# EAGLE design Komorebi_kit (EAGLE 9.2.0)
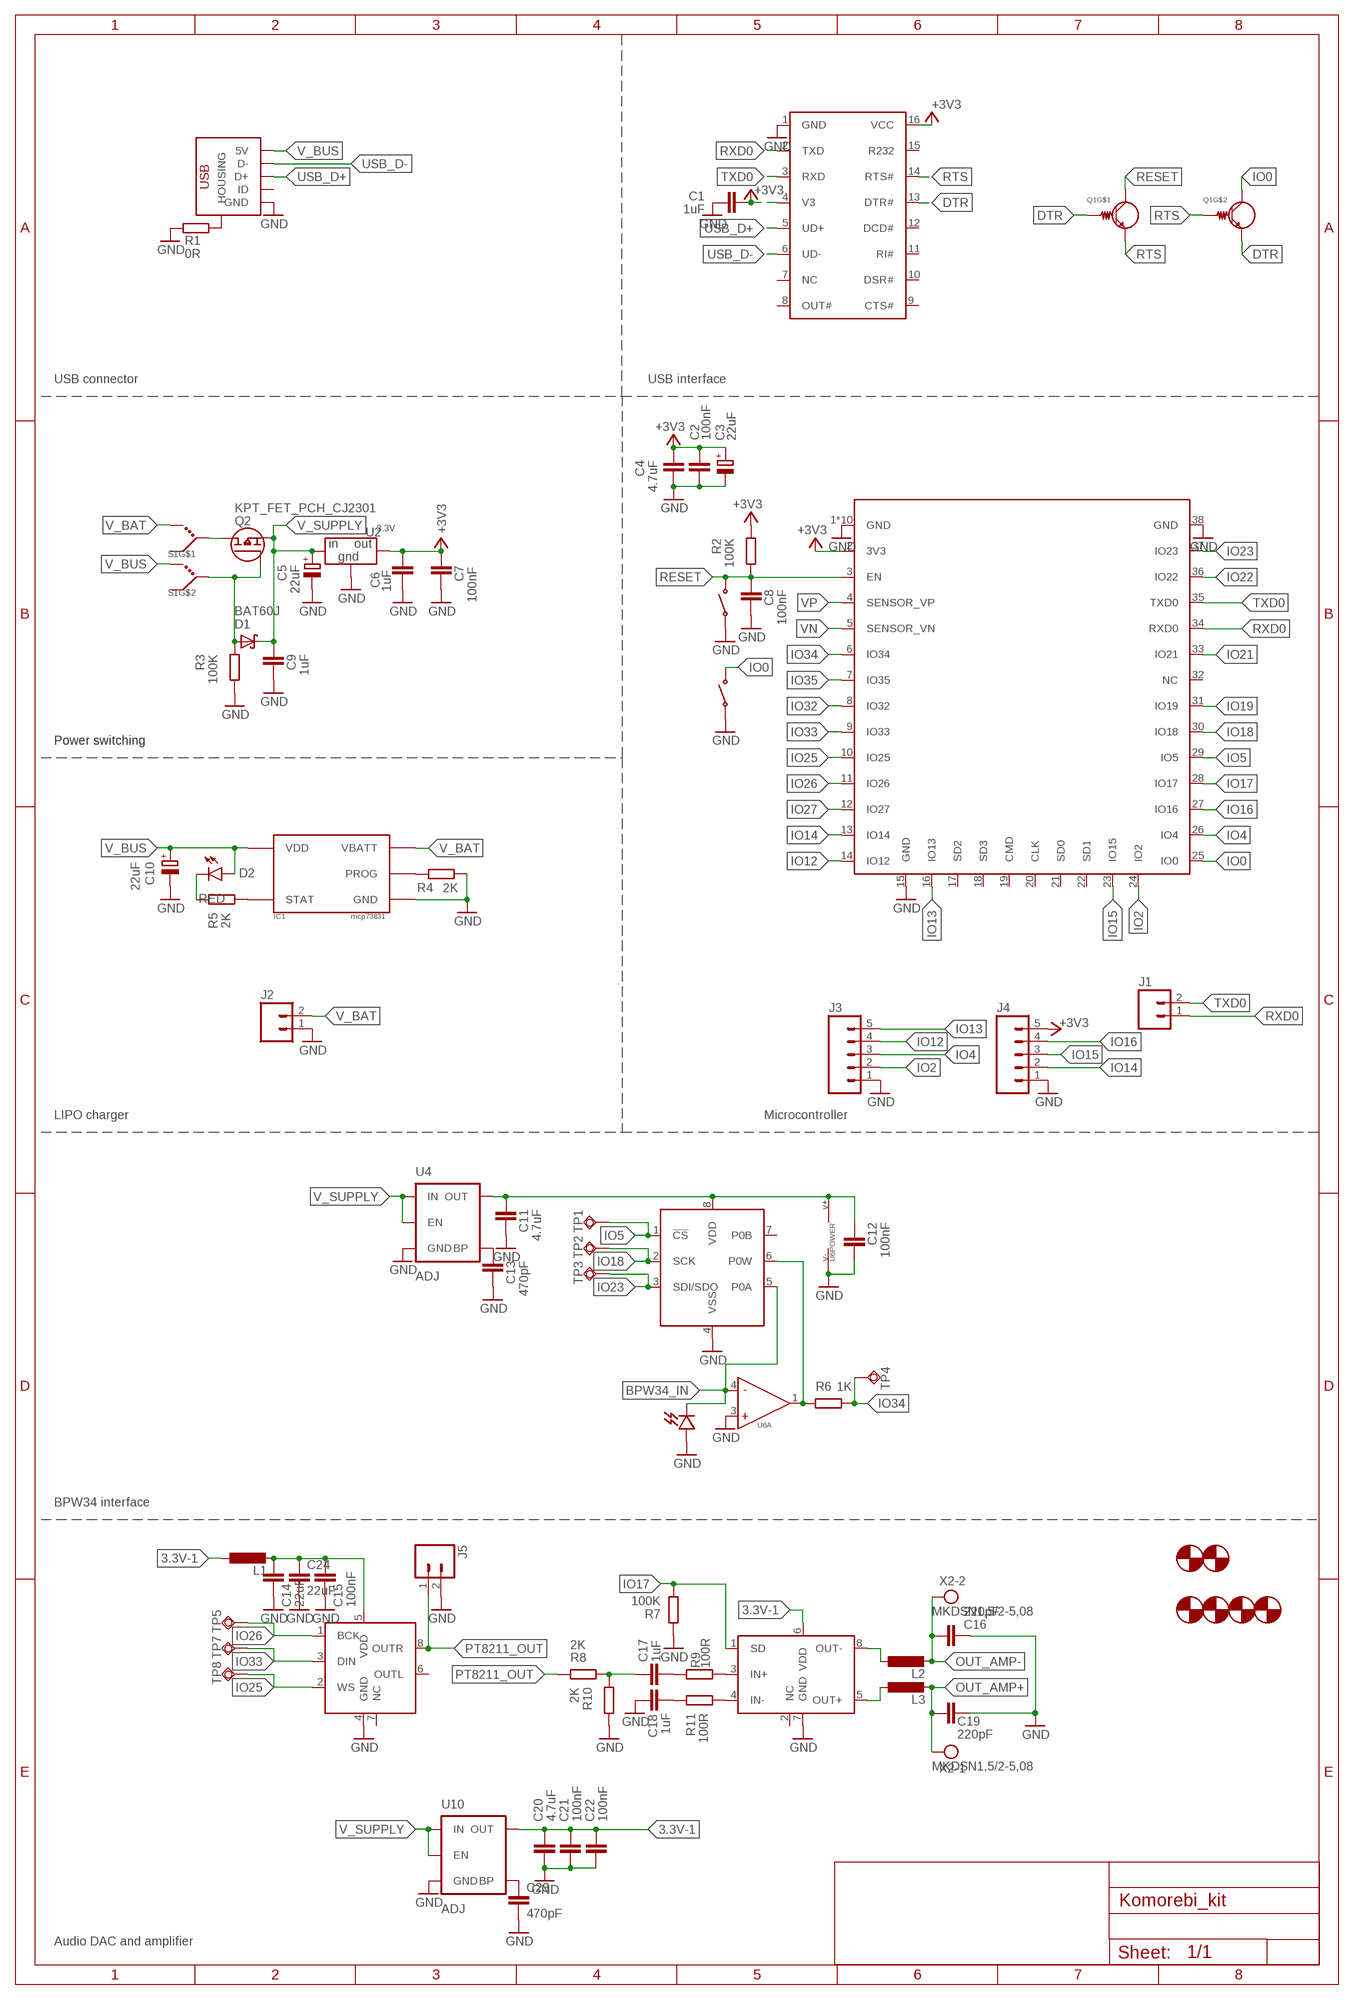
[diagram p0: schematic, sheet 1]

## Parts
C1  1uF  C-EUC0603  [C0603]
C2  100nF  C-EUC0603  [C0603]
C3  22uF  CPOL-EUB  [PANASONIC_B]
C4  4.7uF  C-EUC0603  [C0603]
C5  22uF  CPOL-EUB  [PANASONIC_B]
C6  1uF  C-EUC0603  [C0603]
C7  100nF  C-EUC0603  [C0603]
C8  100nF  C-EUC0603  [C0603]
C9  1uF  C-EUC0603  [C0603]
C10  22uF  CPOL-EUB  [PANASONIC_B]
C11  4.7uF  C-EUC0603  [C0603]
C12  100nF  C-EUC0603  [C0603]
C13  470pF  C-EUC0603  [C0603]
C14  22uF  C-EUC0805  [C0805]
C15  100nF  C-EUC0603  [C0603]
C16  220pF  C-EUC0603  [C0603]
C17  1uF  C-EUC0603  [C0603]
C18  1uF  C-EUC0603  [C0603]
C19  220pF  C-EUC0603  [C0603]
C20  4.7uF  C-EUC0603  [C0603]
C21  100nF  C-EUC0603  [C0603]
C22  100nF  C-EUC0603  [C0603]
C23  470pF  C-EUC0603  [C0603]
C24  22uF  C-EUC0805  [C0805]
D1  BAT60J  [SOD323_ST]
D2  RED  LED1206  [LED-1206]
D3  KPT_SENSORS_BPW34  [BPW34]
H1  KPT_HOLE3.0  [3.0MOUNTHOLE]
H2  KPT_HOLE3.0  [3.0MOUNTHOLE]
H3  KPT_HOLE4.1  [4.1MOUNTHOLE]
H4  KPT_HOLE4.1  [4.1MOUNTHOLE]
H5  KPT_HOLE4.1  [4.1MOUNTHOLE]
H6  KPT_HOLE4.1  [4.1MOUNTHOLE]
IC1  KPT_CHARGER_MCP73831  [SOT23-5]
J1  M02PTH  [1X02]
J2  M02PTH  [1X02]
J3  M05PTH  [1X05]
J4  M05PTH  [1X05]
J5  M02PTH  [1X02]
L1  L-EUL2012C  [L2012C]
L2  L-EUL2012C  [L2012C]
L3  L-EUL2012C  [L2012C]
Q1  KPT_UMH3N  [SOT363]
Q2  KPT_FET_PCH_CJ2301  [SOT23]
R1  0R  R-EU_R0603  [R0603]
R2  100K  R-EU_R0603  [R0603]
R3  100K  R-EU_R0603  [R0603]
R4  2K  R-EU_R0603  [R0603]
R5  2K  R-EU_R0603  [R0603]
R6  1K  R-EU_R0603  [R0603]
R7  100K  R-EU_R0603  [R0603]
R8  2K  R-EU_R0603  [R0603]
R9  100R  R-EU_R0603  [R0603]
R10  2K  R-EU_R0603  [R0603]
R11  100R  R-EU_R0603  [R0603]
S1  KPT_SWITCH_JS202011AQN  [C&K_JS202011AQN]
S2  TACT_SWITCH_C318884  [SWITCH_TACTILE_C318884]
S3  TACT_SWITCH_C318884  [SWITCH_TACTILE_C318884]
TP1  TPSQB1,27  [B1,27]
TP2  TPSQB1,27  [B1,27]
TP3  TPSQB1,27  [B1,27]
TP4  TPSQB1,27  [B1,27]
TP5  TPSQB1,27  [B1,27]
TP7  TPSQB1,27  [B1,27]
TP8  TPSQB1,27  [B1,27]
U1  KPT_CH340C  [SOIC16]
U2  3.3V  KPT_VREG_APT7215  [SOT-89-3L]
U3  KPT_ESP32  [WROOM_ESP32]
U4  ADJ  V_REG_MIC5205ADJ  [SOT23-5]
U5  KPT_DIGIPOT_MCP41X1SOIC8  [SOIC-8]
U6  KPT_OPAMP_MCP6001  [SOT23-5]
U7  KPT_DAC_PT8211  [SOIC-8]
U8  KPT_AMP-D_PAM8302SOIC8  [SOIC-8]
U10  ADJ  V_REG_MIC5205ADJ  [SOT23-5]
X1  USB_MICROB_C10418  [USB_MICROB_C10418]
X2  MKDSN1,5/2-5,08  [MKDSN1,5/2-5,08]

## Nets
3.3V-1: C20.1 C21.1 C22.1 L1.1 U8.6(VDD) U10.5(OUT)
+3V3: C1.2 C2.1 C3.+ C4.2 C6.1 C7.1 J4.5 R2.2 U1.4(V3) U1.16(VCC) U2.P$3(OUT) U3.2(3V3)
BPW34_IN: D3.CATHODE U5.5(P0A) U6.4(A:-)
DTR: Q1.2(BASE) Q1.4(EMITTER) U1.13(DTR#)
GND: C1.1 C2.2 C3.- C4.1 C5.- C6.2 C7.2 C8.2 C9.2 C10.- C11.2 C12.2 C13.2 C14.2 C15.2 C16.1 C18.1 C19.1 C20.2 C21.2 C22.2 C23.2 C24.2 D3.ANODE IC1.2(GND) J2.1 J3.1 J4.1 J5.2 R1.1 R3.1 R4.2 R7.1 R10.1 S2.A S2.B S3.A S3.B U1.1(GND) U2.P$1(GND) U3.1(GND) U3.15(GND) U3.38(GND) U3.BP1(GND) U3.BP2(GND) U3.BP3(GND) U3.BP4(GND) U3.BP5(GND) U3.BP6(GND) U3.BP7(GND) U3.BP8(GND) U3.BP9(GND) U4.2(GND) U5.4(VSS) U6.2(POWER:V-) U6.3(A:+) U7.4(GND) U8.7(GND) U10.2(GND) X1.P$1(GND)
IN_AMP1: C17.1 R8.2 R10.2
IO0: Q1.3(COLLECTOR) S3.C S3.D U3.25(IO0)
IO2: J3.2 U3.24(IO2)
IO4: J3.3 U3.26(IO4)
IO5: TP1.TP U3.29(IO5) U5.1(!CS!)
IO12: J3.4 U3.14(IO12)
IO13: J3.5 U3.16(IO13)
IO14: J4.2 U3.13(IO14)
IO15: J4.3 U3.23(IO15)
IO16: J4.4 U3.27(IO16)
IO17: R7.2 U3.28(IO17) U8.1(SD)
IO18: TP2.TP U3.30(IO18) U5.2(SCK)
IO19: U3.31(IO19)
IO21: U3.33(IO21)
IO22: U3.36(IO22)
IO23: TP3.TP U3.37(IO23) U5.3(SDI/SDO)
IO25: TP8.TP U3.10(IO25) U7.2(WS)
IO26: TP5.TP U3.11(IO26) U7.1(BCK)
IO27: U3.12(IO27)
IO32: U3.8(IO32)
IO33: TP7.TP U3.9(IO33) U7.3(DIN)
IO34: R6.1 TP4.TP U3.6(IO34)
IO35: U3.7(IO35)
N$1: C14.1 C15.1 C24.1 L1.2 U7.5(VDD)
N$2: C11.1 C12.1 U4.5(OUT) U5.8(VDD) U6.5(POWER:V+)
N$3: R1.2 X1.P$6(HOUSING) X1.P$7(HOUSING) X1.P$8(HOUSING) X1.P$9(HOUSING)
N$4: C17.2 R9.1
N$5: C18.2 R11.1
N$6: R9.2 U8.3(IN+)
N$7: IC1.5(PROG) R4.1
N$8: R11.2 U8.4(IN-)
N$9: C23.1 U10.4(BP)
N$11: L2.1 U8.8(OUT-)
N$12: L3.1 U8.5(OUT+)
N$18: D1.A Q2.1(G) R3.2 S1.P$5(COM)
N$19: Q2.3(D) S1.P$2(COM)
N$25: D2.C R5.1
N$39: C13.1 U4.4(BP)
N$40: IC1.1(STAT) R5.2
N$41: R6.2 U5.6(P0W) U6.1(A:OUT)
OUT_AMP+: C19.2 L3.2 X2.1
OUT_AMP-: C16.2 L2.2 X2.2
PT8211_OUT: J5.1 R8.1 U7.8(OUTR)
RESET: C8.1 Q1.6(COLLECTOR) R2.1 S2.C S2.D U3.3(EN)
RTS: Q1.1(EMITTER) Q1.5(BASE) U1.14(RTS#)
RXD0: J1.1 U1.2(TXD) U3.34(RXD0)
TXD0: J1.2 U1.3(RXD) U3.35(TXD0)
USB_D+: U1.5(UD+) X1.P$3(D+)
USB_D-: U1.6(UD-) X1.P$4(D-)
V_BAT: IC1.3(VBATT) J2.2 S1.P$3(SW_ACTION)
V_BUS: C10.+ D2.A IC1.4(VDD) S1.P$6(SW_ACTION) X1.P$5(5V)
V_SUPPLY: C5.+ C9.1 D1.C Q2.2(S) U2.P$2(IN) U2.P$4(IN) U4.1(IN) U4.3(EN) U10.1(IN) U10.3(EN)
VN: U3.5(SENSOR_VN)
VP: U3.4(SENSOR_VP)
Unconnected: S1.P$1(SW_REST) S1.P$4(SW_REST) U1.7(NC) U1.8(OUT#) U1.9(CTS#) U1.10(DSR#) U1.11(RI#) U1.12(DCD#) U1.15(R232) U3.17(SD2) U3.18(SD3) U3.19(CMD) U3.20(CLK) U3.21(SD0) U3.22(SD1) U3.32(NC) U5.7(P0B) U7.6(OUTL) U7.7(NC) U8.2(NC) X1.P$2(ID)

## Notes on the sheet
- USB connector | USB interface
- Power switching | Power switching
- LIPO charger | Microcontroller
- BPW34 interface
- Audio DAC and amplifier

## Library data of the parts
C1 C2 C4 C6-C9 C11-C24 = rcl:C-EU: CAPACITOR, European symbol; SPICEPREFIX: C
C3 C5 C10 = rcl:CPOL-EU: POLARIZED CAPACITOR, European symbol; SPICEPREFIX: C
D1 = diode:BAT60J: Schottky barrier diode Source: www.st.com, BAT60J.pdf
D2 = SparkFun-LED:LED: LEDs Standard schematic elements and footprints for 5mm, 3mm, 1206, and 0603 sized LEDs. 5mm - Spark Fun Electronics SKU : COM-00529 (and others)
D3 = KPT_own:KPT_SENSORS_BPW34
H1-H6 = KPT_own:KPT_HOLE
IC1 = KPT_own:KPT_CHARGER_MCP73831: single cell LiPo charger, 15 to 500 mA, 4,2 Volt. Input range 3.75 to 6 Volt
J1 J2 J5 = SparkFun-Connectors:M02: Standard 2-pin 0.1" header. Use with - straight break away headers ( PRT-00116) - right angle break away headers (PRT-00553) - swiss pins (PRT-00743) - machine pins (PRT-00117) - female headers (PRT-00115) Molex polarized connector foot print use with: PRT-08233 with associated crimp pins and housings. 2.54_SCREWTERM for use with PRT-10571. 3.5mm Screw Terminal footprints for PRT-08084 5mm Screw Terminal footprints for use with PRT-08432
J3 J4 = SparkFun-Connectors:M05: Header 5 Standard 5-pin 0.1" header. Use with straight break away headers (SKU : PRT-00116), right angle break away headers (PRT-00553), swiss pins (PRT-00743), machine pins (PRT-00117), and female headers (PRT-00115). Molex polarized connector foot print use with SKU : PRT-08230 with associated crimp pins and housings.
L1-L3 = rcl:L-EU: INDUCTOR, European symbol; SPICEPREFIX: L
Q1 = KPT_own:KPT_UMH3N
Q2 = KPT_own:KPT_FET_PCH_CJ2301
R1-R11 = rcl:R-EU_: RESISTOR, European symbol; SPICEPREFIX: R
S1 = KPT_own:KPT_SWITCH_JS202011AQN
S2 S3 = KPT_LCSC_Parts:TACT_SWITCH_C318884
TP1-TP5 TP7 TP8 = testpad:TPSQ: Test pad
U1 = KPT_own:KPT_CH340C
U2 = KPT_own:KPT_VREG_APT7215
U3 = KPT_own:KPT_ESP32
U4 U10 = SparkFun-PowerIC:V_REG_MIC5205: V_REG MIC5205 Standard 3.3V, 5V, and Adjustable 150mA LDO voltage regulator in SOT-23 layout. Micrel part MIC5205. BP (by-pass) pin is used to lower output noise with 470pF cap, may be left open. On the adjustable version BP is used to set output.; PROD_ID: VREG-12594
U5 = KPT_own:KPT_DIGIPOT_MCP41X1
U6 = KPT_own:KPT_OPAMP_MCP6001: General purpose, rail to rail, low power opamp. 1.6 to 6.0 V supply
U7 = KPT_own:KPT_DAC_PT8211
U8 = KPT_own:KPT_AMP-D_PAM8302
X1 = KPT_LCSC_Parts:USB_MICROB_C10418
X2 = con-phoenix-508:MKDSN1,5/2-5,08: MKDSN 1,5/ 2-5,08 Printklemme Nennstrom: 13,5 A Nennspannung: 250 V Rastermaß: 5,08 mm Polzahl: 2 Anschlussart: Schraubanschluss Montage: Löten Anschlussrichtung Leiter/Platine: 0 ° Artikelnummer: 1729128 Source: http://eshop.phoenixcontact.com .. 1729128.pdf

## Board
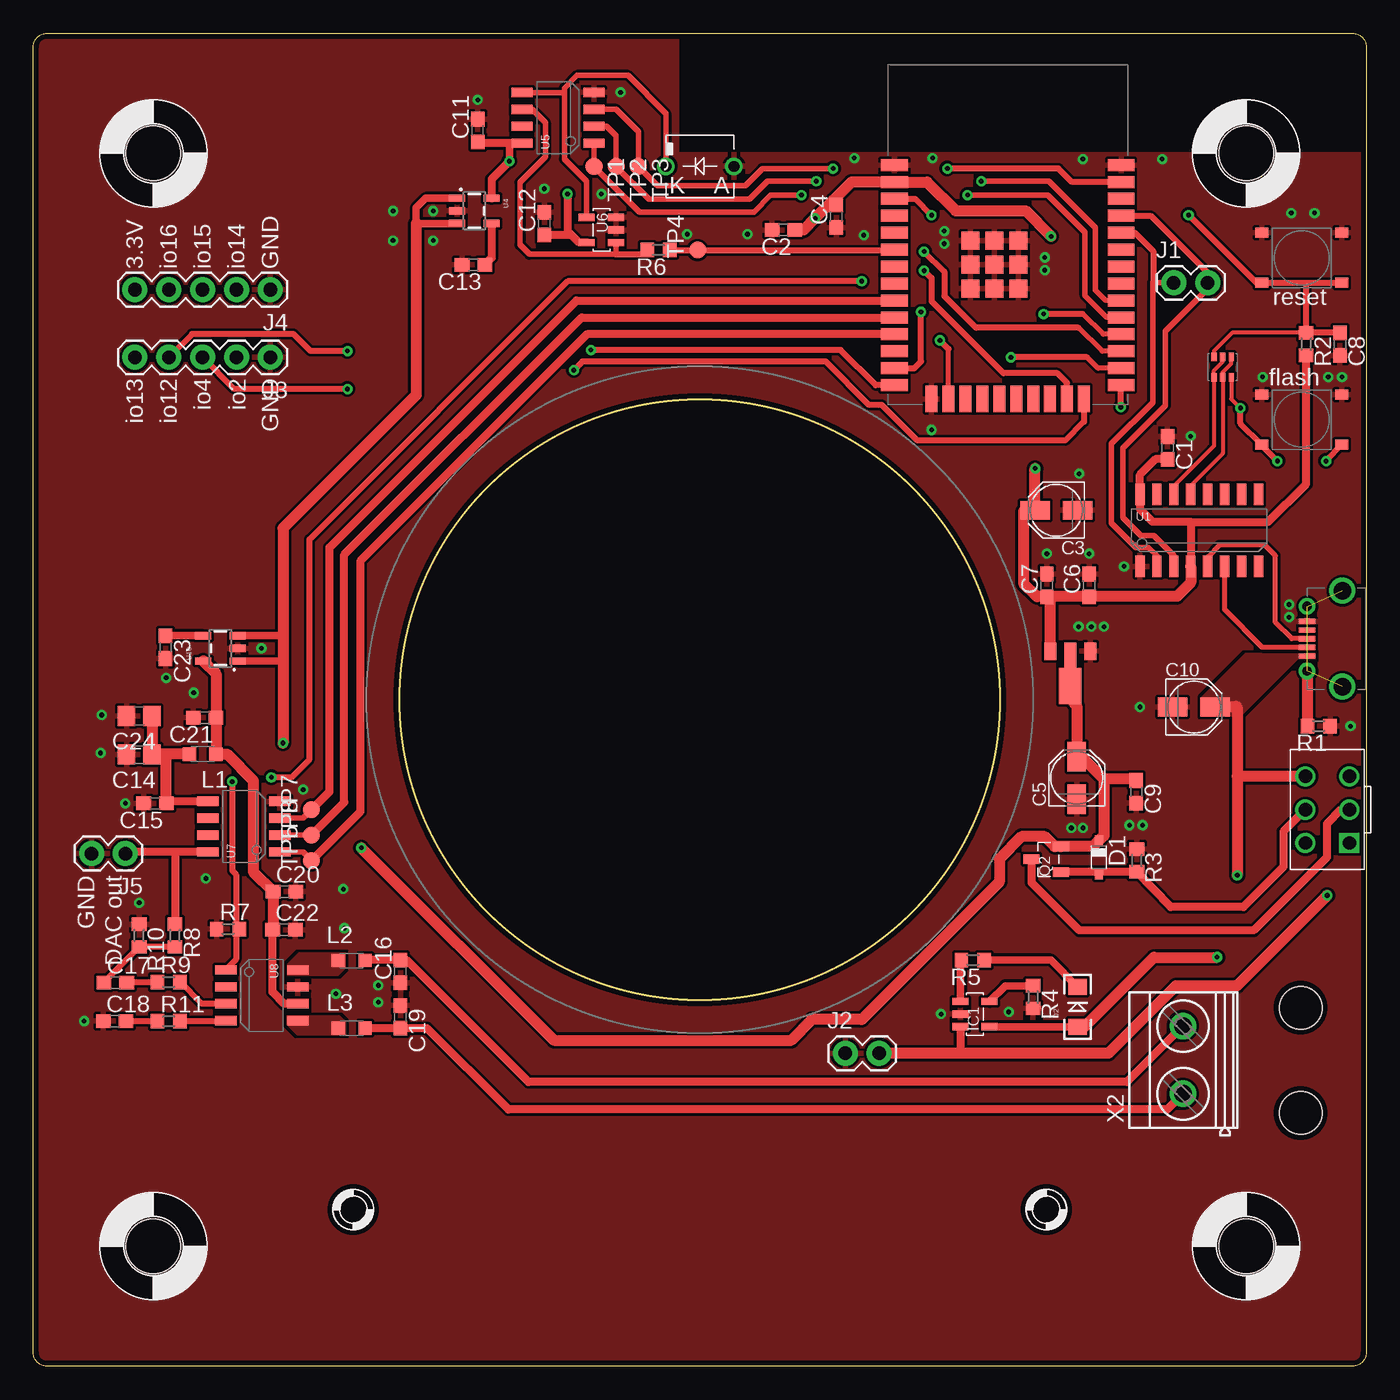
[diagram p1: board, top side]
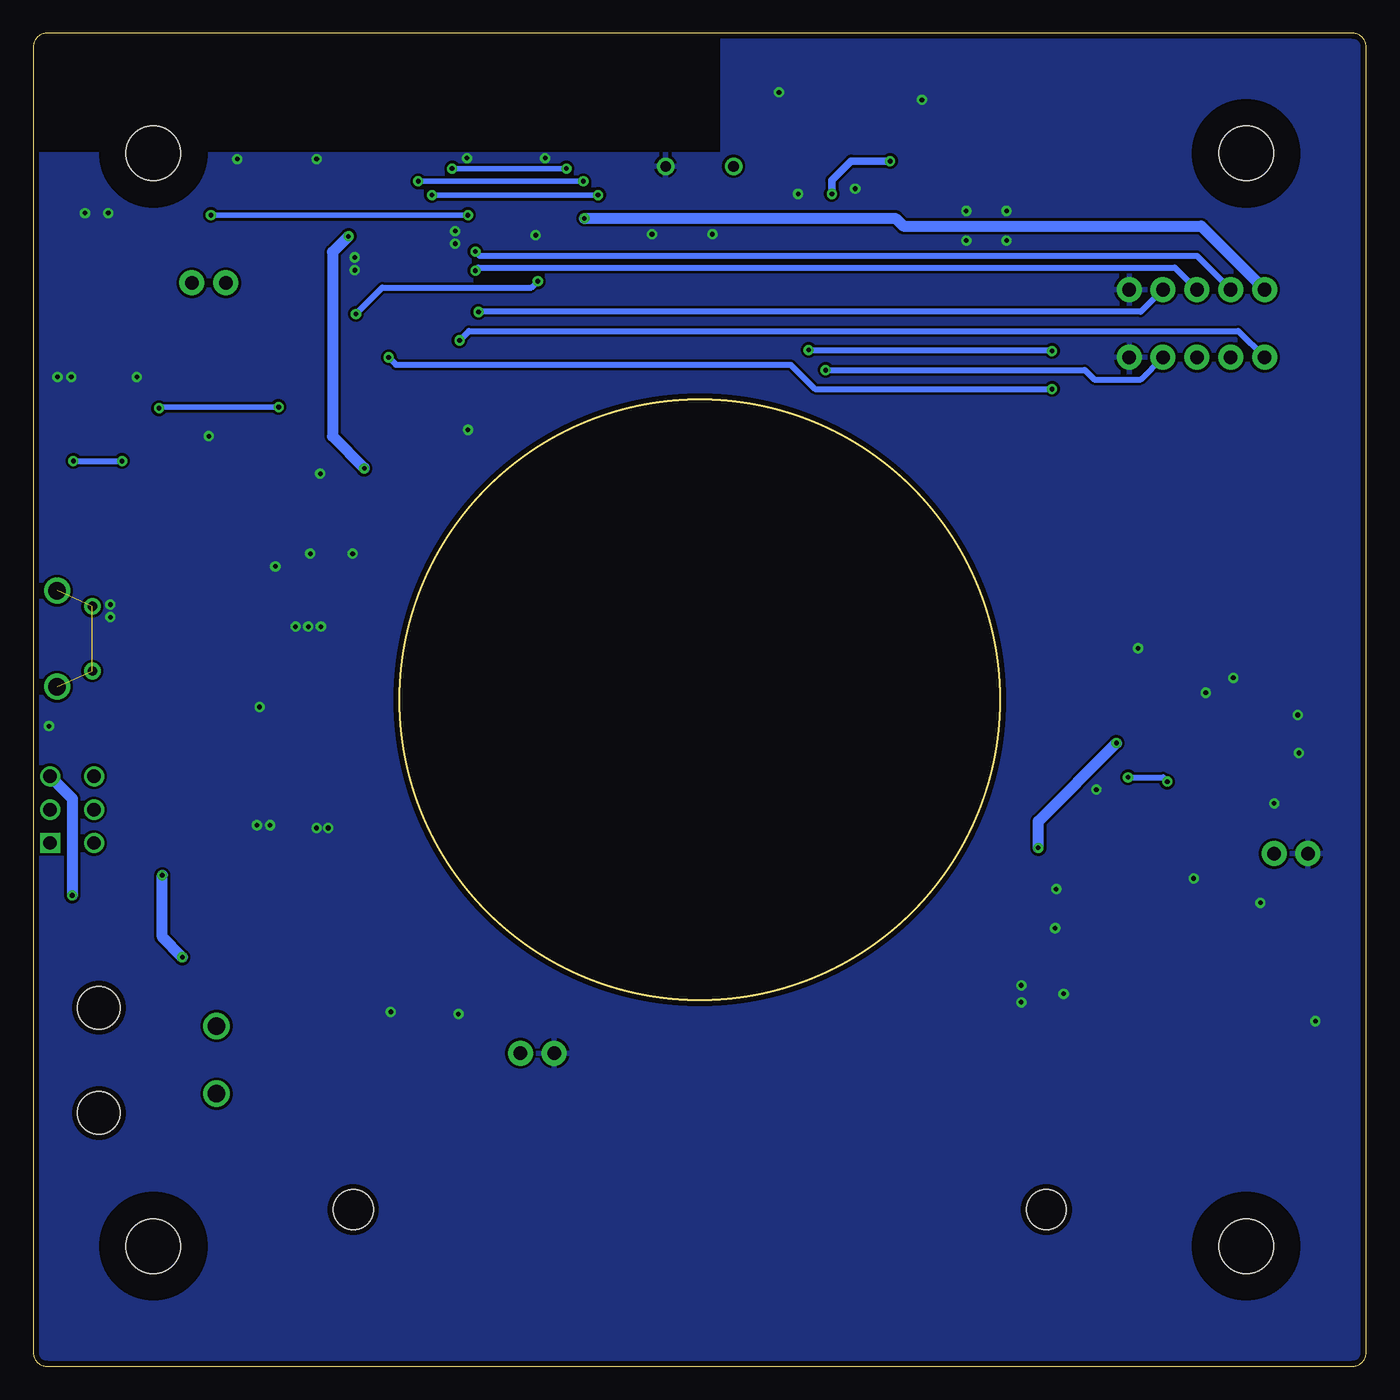
[diagram p2: board, bottom side, seen from below]

Size 100 x 100 mm. Coordinates in mm from the lower left corner, seen from the top.
Outline: 1,0 arc-90 0,1 0,99 arc-90 1,100 99,100 arc-90 100,99 100,1 arc-90 99,0 1,0
Outline: circle at 50,50 radius 22.5
Copper layers (1*16): Top 0.035mm / dielectric 1.5mm / Bottom 0.035mm
Design rules "KPT_standard": minimum track width 8mil, minimum drill 0.35mm, track to track 8mil, track to pad 8mil, pad to pad 8mil, via to via 8mil, smd to smd 8mil, copper to edge 16mil, drill to drill 8mil, minimum pad ring 10mil, minimum via ring 8mil, stop-mask expansion 4mil, vias tented up to drill 0mil, thermal gap 8mil
Holes 3.2 mm at 95.09,26.9 95.09,19

### Footprints (pad centres in the part's own frame; a part is rotated, then mirrored left to right if it is on the bottom)
C0603 = smd 1.1 x 1: 1 -0.85,0; 2 0.85,0
PANASONIC_B = smd 2.2 x 1.4: + 1.6,0; - -1.6,0
C0805 = smd 1.3 x 1.5: 1 -0.95,0; 2 0.95,0
SOD323_ST = smd 0.8 x 0.6: A 1.25,0; C -1.25,0
LED-1206 = smd 1.2 x 1.4: A -1.5,0; C 1.5,0
BPW34 = drill 0.8: ANODE -2.55,0; CATHODE 2.55,0
3.0MOUNTHOLE = hole 3: 0,0
4.1MOUNTHOLE = hole 4.1: 0,0
SOT23-5 = smd 0.55 x 1.2: 1 0.95,1.1; 2 0,1.1; 3 -0.95,1.1; 4 -0.95,-1.1; 5 0.95,-1.1
1X02 = drill 1.016 pad 1.88: 1 0,0; 2 2.54,0
1X05 = drill 1.016 pad 1.88: 1 0,0; 2 2.54,0; 3 5.08,0; 4 7.62,0; 5 10.16,0
L2012C = smd 1 x 1: 1 -1,0; 2 1,0
SOT363 = smd 0.65 x 0.4: 1 -0.775,0.65; 2 -0.775,0; 3 -0.775,-0.65; 4 0.775,-0.65; 5 0.775,0; 6 0.775,0.65
SOT23 = smd 0.711 x 1.2: 1 -0.95,-1.1; 2 0.95,-1.1; 3 0,1.1
R0603 = smd 1 x 1.1: 1 -0.85,0; 2 0.85,0
C&K_JS202011AQN = drill 1 square: P$1 -2.5,0 | drill 1: P$2 0,0; P$3 2.5,0; P$4 -2.5,3.3; P$5 0,3.3; P$6 2.5,3.3
SWITCH_TACTILE_C318884 = smd 1 x 0.75: A -3,1.875; B 3,1.875; C -3,-1.875; D 3,-1.875
B1,27 = smd 1.27 x 1.27: TP 0,0
SOIC16 = smd 1.6 x 0.7: 1 -2.7,4.445; 2 -2.7,3.175; 3 -2.7,1.905; 4 -2.7,0.635; 5 -2.7,-0.635; 6 -2.7,-1.905; 7 -2.7,-3.175; 8 -2.7,-4.445; 9 2.7,-4.445; 10 2.7,-3.175; 11 2.7,-1.905; 12 2.7,-0.635; 13 2.7,0.635; 14 2.7,1.905; 15 2.7,3.175; 16 2.7,4.445
SOT-89-3L = smd 0.9 x 1.3: P$1 -1.5,-1.5; P$3 1.5,-1.5 | smd 0.9 x 1.9: P$2 0,-1.2 | smd 1.7 x 2.7: P$4 0,1.1
WROOM_ESP32 = smd 2 x 0.9: 1 -8.5,3.2; 2 -8.5,1.93; 3 -8.5,0.66; 4 -8.5,-0.61; 5 -8.5,-1.88; 6 -8.5,-3.15; 7 -8.5,-4.42; 8 -8.5,-5.69; 9 -8.5,-6.96; 10 -8.5,-8.23; 11 -8.5,-9.5; 12 -8.5,-10.77; 13 -8.5,-12.04; 14 -8.5,-13.31; 25 8.51,-13.31; 26 8.51,-12.04; 27 8.51,-10.77; 28 8.51,-9.5; 29 8.51,-8.23; 30 8.51,-6.96; 31 8.51,-5.69; 32 8.51,-4.42; 33 8.51,-3.15; 34 8.51,-1.88; 35 8.51,-0.61; 36 8.51,0.66; 37 8.51,1.93; 38 8.51,3.2 | smd 0.9 x 2: 15 -5.71,-14.35; 16 -4.44,-14.35; 17 -3.17,-14.35; 18 -1.9,-14.35; 19 -0.63,-14.35; 20 0.64,-14.35; 21 1.91,-14.35; 22 3.18,-14.35; 23 4.45,-14.35; 24 5.72,-14.35 | smd 1.33 x 1.33: BP1 -2.8,-2.48; BP2 -1,-2.48; BP3 0.8,-2.48; BP4 -2.8,-4.28; BP5 -1,-4.28; BP6 0.8,-4.28; BP7 -2.8,-6.08; BP8 -1,-6.08; BP9 0.8,-6.08
SOT23-5' = smd 0.55 x 1.2: 1 -0.95,-1.3; 2 0,-1.3; 3 0.95,-1.3; 4 0.95,1.3; 5 -0.95,1.3
SOIC-8 = smd 1.6 x 0.7: 1 -2.7,1.905; 2 -2.7,0.635; 3 -2.7,-0.635; 4 -2.7,-1.905; 5 2.7,-1.905; 6 2.7,-0.635; 7 2.7,0.635; 8 2.7,1.905
USB_MICROB_C10418 = smd 0.4 x 1.25: P$1 -1.3,-2.54; P$2 -0.65,-2.54; P$3 0,-2.54; P$4 0.65,-2.54; P$5 1.3,-2.54 | drill 0.7 pad 1.25: P$6 -2.425,-2.54; P$7 2.425,-2.54 | drill 1.3: P$8 3.6,0.11; P$9 -3.6,0.11
MKDSN1,5/2-5,08 = drill 1.3 pad 2: 1 -2.561,0.025; 2 2.519,0.025

### Placement (x,y rotation side)
C1  85.09,68.9 270 top
C2  56.28,85.25 180 top
C3  76.76,64.21 180 top
C4  60.25,86.28 90 top
C5  78.28,44.14 90 top
C6  79.22,58.58 90 top
C7  76.04,58.58 90 top
C8  98.03,76.68 270 top
C9  82.75,43.09 270 top
C10  87.07,49.45 0 top
C11  33.34,92.71 90 top
C12  38.34,85.72 90 top
C13  33.02,82.63 180 top
C14  7.94,45.88 180 top
C15  9.13,42.23 180 top
C16  27.54,29.62 90 top
C17  6.16,28.78 0 top
C18  6.11,25.89 0 top
C19  27.54,26.21 270 top
C20  18.85,35.61 0 top
C21  12.86,48.66 180 top
C22  18.81,32.75 0 top
C23  9.92,53.94 270 top
C24  7.94,48.78 180 top
D1  79.94,38.18 270 top
D2  78.34,26.97 90 top
D3  50.01,90.02 180 top
H1  24,11.75 0 top
H2  76,11.75 0 top
H3  9,9 0 top
H4  9,91 0 top
H5  91,9 0 top
H6  91,91 0 top
IC1  70.65,26.42 90 top
J1  85.57,81.28 0 top
J2  60.92,23.48 0 top
J3  17.78,75.69 180 top
J4  17.78,80.77 180 top
J5  6.91,38.46 180 top
L1  12.7,45.92 180 top
L2  23.89,30.45 0 top
L3  23.89,25.37 0 top
Q1  89.23,74.96 90 top
Q2  75.99,38.03 90 top
R1  96.44,48.02 180 top
R2  95.49,76.68 270 top
R3  82.79,37.94 270 top
R4  75.01,27.69 270 top
R5  70.49,30.47 180 top
R6  46.91,83.74 180 top
R7  14.61,32.79 0 top
R8  10.64,32.31 270 top
R9  10.16,28.81 0 top
R10  7.94,32.31 270 top
R11  10.16,25.88 0 top
S1  98.74,41.75 90 top
S2  95.17,83.15 0 top
S3  95.17,71.01 0 top
TP1  42.07,90.01 270 top
TP2  43.74,90.01 270 top
TP3  45.4,90.01 270 top
TP4  49.85,83.74 90 top
TP5  20.88,37.94 90 top
TP7  20.88,41.75 90 top
TP8  20.88,39.85 90 top
U1  87.47,62.71 90 top
U2  77.79,52.15 180 top
U3  73.1,86.92 0 top
U4  ADJ  [SOT23-5']  33.1,86.68 270 top
U5  39.37,93.66 180 top
U6  42.62,85.25 270 top
U7  15.8,40.48 180 top
U8  17.14,27.83 0 top
U10  ADJ  [SOT23-5']  14.05,53.86 90 top
X1  98.11,54.58 270 top
X2  86.28,23 90 top

### Tracks (layer width: path | path; a pad name or v marks a point on that pad's centre or on a via)
3.3V-1
  Top 0.61: U8.6 18.81,27.19 17.94,28.06 17.94,32.73 18,32.78
  Top 0.813: C22.1 18,32.78 C20.1 16.51,37.09 16.51,43.94 14.53,45.92 L1.1 13.71,45.93 C21.1 13.71,51.95 U10.5
+3V3  (via drill 0.35)
  Top 0.61: 86.84,63.34 83.98,63.34 83.03,64.29 U1.16 83.03,66.88 84.19,68.05 C1.2 | 86.84,63.34 92.63,63.34 95.49,66.2 R2.2 | 86.84,63.34 U1.4
  Top 0.635: 79.24,57.75 C6.1
  Top 0.813: v76.36,84.77 74.45,86.68 69.22,86.68 67.05,88.85 U3.2 61.38,88.85 60.03,87.49 | 60.03,87.49 v58.66,86.12 57.78,85.25 C2.1 | C4.2 60.03,87.35 60.03,87.49 | U1.4 86.84,58.78 85.8,57.75 79.24,57.75 | C6.1 C7.1 | C7.1 75.3,57.73 74.3,58.74 74.3,64.13 74.37,64.21 C3.+ 75.16,67.34 v75.17,67.36 | U2.P$3 76.29,57.48 C7.1
  Bottom 0.813: v76.36,84.77 77.55,83.58 77.55,69.77 75.17,67.39 v75.17,67.36 | v58.66,86.12 35.32,86.12 34.73,85.53 12.38,85.53 J4.5
BPW34_IN
  Top 0.406: U6.4 41.52,88.89 39.85,90.57 39.85,95.53 | 39.85,95.53 39.85,95.89 40.8,96.84 44.61,96.84 47.47,93.98 D3.CATHODE | U5.5 36.7,95.53 39.85,95.53
DTR
  Top 0.305: Q1.4 89.88,75.21 89.23,74.56 Q1.2 89.23,68.48 86.84,66.09 U1.13
GND  (via drill 0.35)
  other vias: 30,86.68 38.34,88.34 44.05,95.57 49.05,84.93 42.62,87.95 30,84.45 33.34,95.01 53.58,84.93 61.59,90.65 62.31,84.85 84.69,90.57 67.39,70.25 94.38,86.52 96.12,86.52 86.84,69.77 98.19,74.22 81.84,60.01 79.22,60.96 76.04,60.96 94.22,57.15 94.22,56.2 83.03,49.45 79.38,55.48 78.75,40.38 83.22,40.59 82.24,40.59 73.19,26.58 68.11,26.42 25.88,27.3 25.88,28.57 22.7,27.94 3.81,25.89 12.94,36.59 23.26,35.8 7.94,34.77 6.91,42.23 20.24,43.26 5.05,46 78.47,66.96 5.13,48.86 77.88,40.38 98.82,48.02 26.99,86.68 67.47,90.65 26.99,84.45 78.74,90.57 23.34,32.86 92.23,74.22 97.16,74.22 68.34,85.17 68.34,84.22 75.88,83.19 75.88,82.23 78.42,55.48 80.33,55.48 9.97,51.64 17.11,53.86 12.03,50.53
  pour Bottom: -0.11,-0.02 100.01,-0.02 100.01,90.88 48.26,90.88 48.26,100.01 -0.11,100.01
  pour Top (rank 2): -0.11,-0.02 100.01,-0.02 100.01,90.88 48.26,90.88 48.26,100.01 -0.11,100.01
IN_AMP1
  Top 0.432: C17.1 5.31,28.83 R10.2 R8.2
IO0  (via drill 0.35)
  Top 0.305: Q1.3 89.88,72.57 v90.57,71.88
  Top 0.432: v93.34,67.91 92.17,69.09 S3.C 90.57,70.74 v90.57,71.88 | S3.D 97,67.96 v97,67.91 | v81.6,71.96 81.6,73.59 U3.25
  Bottom 0.406: v90.57,71.88 90.49,71.96 v81.6,71.96
  Bottom 0.432: v97,67.91 v93.34,67.91
IO2  (via drill 0.35)
  Top 0.432: v40.56,74.74 41.2,75.37 41.73,75.37 41.74,75.37 42.4,75.37 59.45,75.37 62.71,72.12 63.66,72.12 66.33,69.45 77.42,69.45 78.82,70.85 U3.24
  Bottom 0.432: v40.56,74.74 21.11,74.74 20.4,74.02 16.91,74.02 J3.2
IO4  (via drill 0.35)
  Top 0.381: U3.26 79.87,74.88 79.06,75.69
  Top 0.432: 79.06,75.69 v73.34,75.69 | v23.57,73.31 15.08,73.31 J3.3
  Bottom 0.432: v73.34,75.69 72.79,75.13 43.18,75.13 41.35,73.31 v23.57,73.31
IO5  (via drill 0.35)
  Top 0.381: U3.29 80.54,78.69 78.9,80.33
  Top 0.406: 78.9,80.33 78.9,85.09 76.12,87.87 v70.09,87.87 | U5.1 TP1.TP 45.48,86.6 54.05,86.6 55.32,87.87 v57.63,87.87
  Bottom 0.406: v70.09,87.87 v57.63,87.87
IO12  (via drill 0.35)
  Top 0.432: v41.83,76.25 60.56,76.25 63.2,73.61 U3.14 | v23.57,76.17 20.8,76.17 19.53,77.44 11.91,77.44 J3.4
  Bottom 0.432: v41.83,76.25 23.65,76.25 v23.57,76.17
IO13  (via drill 0.35)
  Top 0.381: U3.16 68.66,76.32
  Top 0.432: 68.66,76.32 v68.02,76.96
  Bottom 0.432: J3.5 9.6,77.67 67.31,77.67 v68.02,76.96
IO14  (via drill 0.35)
  Top 0.432: v66.6,79.1 66.6,75.37 66.1,74.88 U3.13
  Bottom 0.432: J4.2 16.91,79.1 v66.6,79.1
IO15  (via drill 0.35)
  Top 0.432: v66.83,82.2 67.39,81.64 67.39,79.9 72.79,74.5 76.83,74.5 77.55,73.78 U3.23
  Bottom 0.432: v66.83,82.2 66.6,82.44 14.37,82.44 J4.3
IO16  (via drill 0.35)
  Top 0.381: U3.27 80.19,76.15 78.42,77.91
  Top 0.432: 78.42,77.91 70.72,77.91 68.34,80.29 68.34,82.12 v66.83,83.63
  Bottom 0.432: v66.83,83.63 66.52,83.31 12.7,83.31 J4.4
IO17  (via drill 0.35)
  Top 0.381: U3.28 80.27,77.42 78.74,78.94
  Top 0.432: v14.92,43.86 14.92,37.19 15.22,36.9 15.22,33.03 R7.2 15.22,32.56 15.22,30.5 U8.1 | 78.74,78.94 v75.8,78.94 | v62.15,81.41 40.08,81.41 20.72,62.04 20.72,45.53 19.37,44.18 v17.86,44.18
  Bottom 0.432: v14.92,43.86 15.24,44.18 v17.86,44.18 | v62.15,81.41 62.63,80.93 73.82,80.93 v75.8,78.94
IO18  (via drill 0.35)
  Top 0.381: U3.30 80.46,79.96 79.69,80.72
  Top 0.406: 79.69,80.72 79.69,85.41 76.2,88.9 v71.12,88.9 | U5.2 43.02,93.03 43.74,92.31 TP2.TP 46.2,87.55 53.74,87.55 55.09,88.9 v58.74,88.9
  Bottom 0.406: v71.12,88.9 v58.74,88.9
IO23  (via drill 0.35)
  Top 0.406: U5.3 43.74,94.3 45.4,92.63 TP3.TP 46.83,88.58 53.42,88.58 54.69,89.85 v60.01,89.85
  Top 0.432: v68.58,89.85 76.91,89.85 77.92,88.85 U3.37
  Bottom 0.406: v68.58,89.85 v60.01,89.85
IO25
  Top 0.406: TP8.TP U7.2
  Top 0.61: TP8.TP 23.34,42.31 23.34,60.88 41.14,78.69 U3.10
IO26
  Top 0.406: U7.1 20.24,38.58 TP5.TP
  Top 0.61: TP5.TP 24.53,41.59 24.53,60.4 41.54,77.42 U3.11
IO33
  Top 0.406: U7.3 20.24,41.12 TP7.TP
  Top 0.61: TP7.TP 22.23,43.1 22.23,61.44 40.74,79.96 U3.9
IO34
  Top 0.432: R6.1 TP4.TP 64.58,83.74 U3.6
N$1
  Top 0.61: U7.5 11.99,42.39 | 11.99,42.39 10.14,42.39 C15.1 | 11.99,42.39
  Top 0.813: 8.92,45.84 C14.1 | C24.1 8.92,48.75 8.92,45.84 | L1.2 10,45.92 | 10,45.92 9,45.92 8.92,45.84 | C15.1 9.98,45.9 10,45.92
N$2  (via drill 0.35)
  Top 0.559: 35.72,91.76 v35.72,90.41 35.67,90.36
  Top 0.61: U5.8 35.72,91.76 33.44,91.76 C11.1 | 35.67,90.36 35.67,90.33 34.4,89.06 U4.5 | v40.08,87.95 40.08,85.17 40.36,84.89 | U6.5 40.95,84.3 40.36,84.89 | C12.1 40.35,84.88 40.36,84.89
  Bottom 0.559: v35.72,90.41 38.66,90.41 40.08,88.98 v40.08,87.95
N$3  (3 unrouted)
  Top 0.813: X1.P$7 95.57,48.05 R1.2
N$4
  Top 0.432: C17.2 7.04,28.81 R9.1
N$5
  Top 0.432: R11.1 6.97,25.88 C18.2
N$6
  Top 0.432: U8.3 12.63,27.19 R9.2
N$7
  Top 0.559: IC1.5 72.92,28.54 R4.1
N$8
  Top 0.432: U8.4 14.4,25.88 R11.2
N$9
  Top 0.559: U10.4 9.94,54.81 C23.1
N$11
  pour Top (no thermals): 19.05,29.34 22.86,29.34 23.42,29.89 23.42,31 19.92,31 19.05,30.13
N$12
  pour Top (no thermals): 19.05,26.32 22.94,26.32 23.42,25.84 23.42,24.81 19.84,24.81 19.05,25.6
N$18
  Top 0.61: 79.91,37.08 Q2.1 | 79.91,37.08 82.7,37.08 R3.2 85.33,34.45 90.79,34.45 93.8,37.46 93.8,40.11 S1.P$5 | D1.A 79.91,36.96 79.91,37.08
N$19
  Top 0.61: S1.P$2 98.11,41.75 97.04,40.68 97.04,38.18 91.56,32.69 78.47,32.69 74.89,36.28 Q2.3
N$25
  Top 0.559: R5.1 76.35,30.47 D2.C
N$39
  Top 0.61: U4.4 34.4,83.16 C13.1
N$40
  Top 0.559: IC1.1 69.55,30.38 R5.2
N$41
  Top 0.406: U6.1 43.72,83.49 43.66,83.42 37.23,83.42 36.51,84.14 36.51,88.82 38.42,90.73 38.42,93.31 37.43,94.3 U5.6
  Top 0.432: 43.66,83.42 45.74,83.42 R6.2
OUT_AMP+
  Top 0.61: X2.1 85.07,19.25 35.64,19.25 29.54,25.36 C19.2 24.9,25.36 L3.2
OUT_AMP-
  Top 0.61: X2.2 82.06,21.32 37.15,21.32 28,30.47 C16.2 24.91,30.47 L2.2
PT8211_OUT
  Top 0.61: U7.8 10.64,38.58 | 10.64,38.58 7.02,38.58 J5.1 | 10.64,38.58 R8.1
RESET  (via drill 0.35)
  Top 0.305: R2.1 89.94,77.53 88.58,76.16 Q1.6
  Top 0.432: 95.49,81.28 S2.C 91.76,81.28 v86.68,86.36 | 95.49,81.28 S2.D | 95.49,81.28 R2.1 C8.1 | U3.3 66.17,87.58 v67.39,86.36
  Bottom 0.406: v86.68,86.36 v67.39,86.36
RTS
  Top 0.305: Q1.5 89.23,75.36 88.58,74.71 Q1.1 88.58,69.04 88.5,68.96 88.37,68.84 85.58,66.04 U1.14
RXD0
  Top 0.406: U1.2 84.3,60.8 83.66,61.44 82.71,61.44 80.88,63.26 80.88,69.22 83.98,72.31 83.98,81.33 84.02,81.28 J1.1
  Top 0.432: U3.34 82.65,85.04 84.02,83.66 84.02,81.28
TXD0
  Top 0.406: U1.3 85.57,60.8 84.06,62.31 83.11,62.31 81.76,63.66 81.76,68.9 84.93,72.07 84.93,77.67 88.11,80.85 J1.2 88.11,82.04
  Top 0.432: U3.35 83.84,86.31 88.11,82.04
USB_D+
  Top 0.381: U1.5 88.11,60.72 88.98,61.59 92.39,61.59 93.19,60.8 93.19,55.8 94.41,54.58 X1.P$3
USB_D-
  Top 0.381: U1.6 89.38,56.75 92.2,53.93 X1.P$4
V_BAT  (via drill 0.35)
  Top 0.61: IC1.3 69.55,23.48
  Top 0.813: J2.2 69.55,23.48 80.66,23.48 85.72,28.54 90.3,28.54 v97.08,35.32
  Bottom 0.813: v97.08,35.32 97.08,42.58 S1.P$3
V_BUS  (via drill 0.35)
  Top 0.559: IC1.4 D2.A
  Top 0.813: S1.P$6 90.33,44.25 | 90.33,44.25 v90.33,36.83 | 90.33,44.25 90.33,49.45 90.25,49.53 90.17,49.45 C10.+ | D2.A 78.86,25.47 84.07,30.68 v88.82,30.68
  Bottom 0.813: v88.82,30.68 90.33,32.19 v90.33,36.83
  pour Top (no thermals): 96.2,53.5 96.2,53.04 94.87,53.04 90.57,48.74 87.63,48.74 87.63,50.16 90.96,53.5
V_SUPPLY  (via drill 0.35)
  Top 0.559: U4.3 28.73,85.72 28.73,86.92 29.45,87.63 U4.1 | U10.3 18.73,54.81 | U10.1 18.73,52.91
  Top 0.813: U2.P$2 U2.P$4 77.79,50.04 78.28,49.55 C5.+ 78.64,45.74 80.33,44.05 | v24.61,38.89 39.05,24.45 56.87,24.45 58.42,26 62.15,26 72.47,36.32 72.47,38.07 74.14,39.73 75.88,39.73 76.64,38.98 Q2.2 79.49,38.98 D1.C 80.33,39.82 80.33,44.05 | 28.73,85.72 28.73,72.87 18.73,62.87 18.73,54.81 18.73,52.91 v18.73,46.75 | C9.1 82.64,44.05 80.33,44.05
  Bottom 0.813: v24.61,38.89 24.61,40.88 v18.73,46.75

### Text on the board
tPlace: 3.3V | io16 | io15 | io14 | GND | reset | io13 | io12 | io4 | io2 | GND | flash | GND | DAC out
tDocu: Komorebi_Kit